# Altium schematic sheet Archimedes_Cevirici_Kati_LM2596.SchDoc
size A4; SheetNumber: 8; SheetTotal: 8
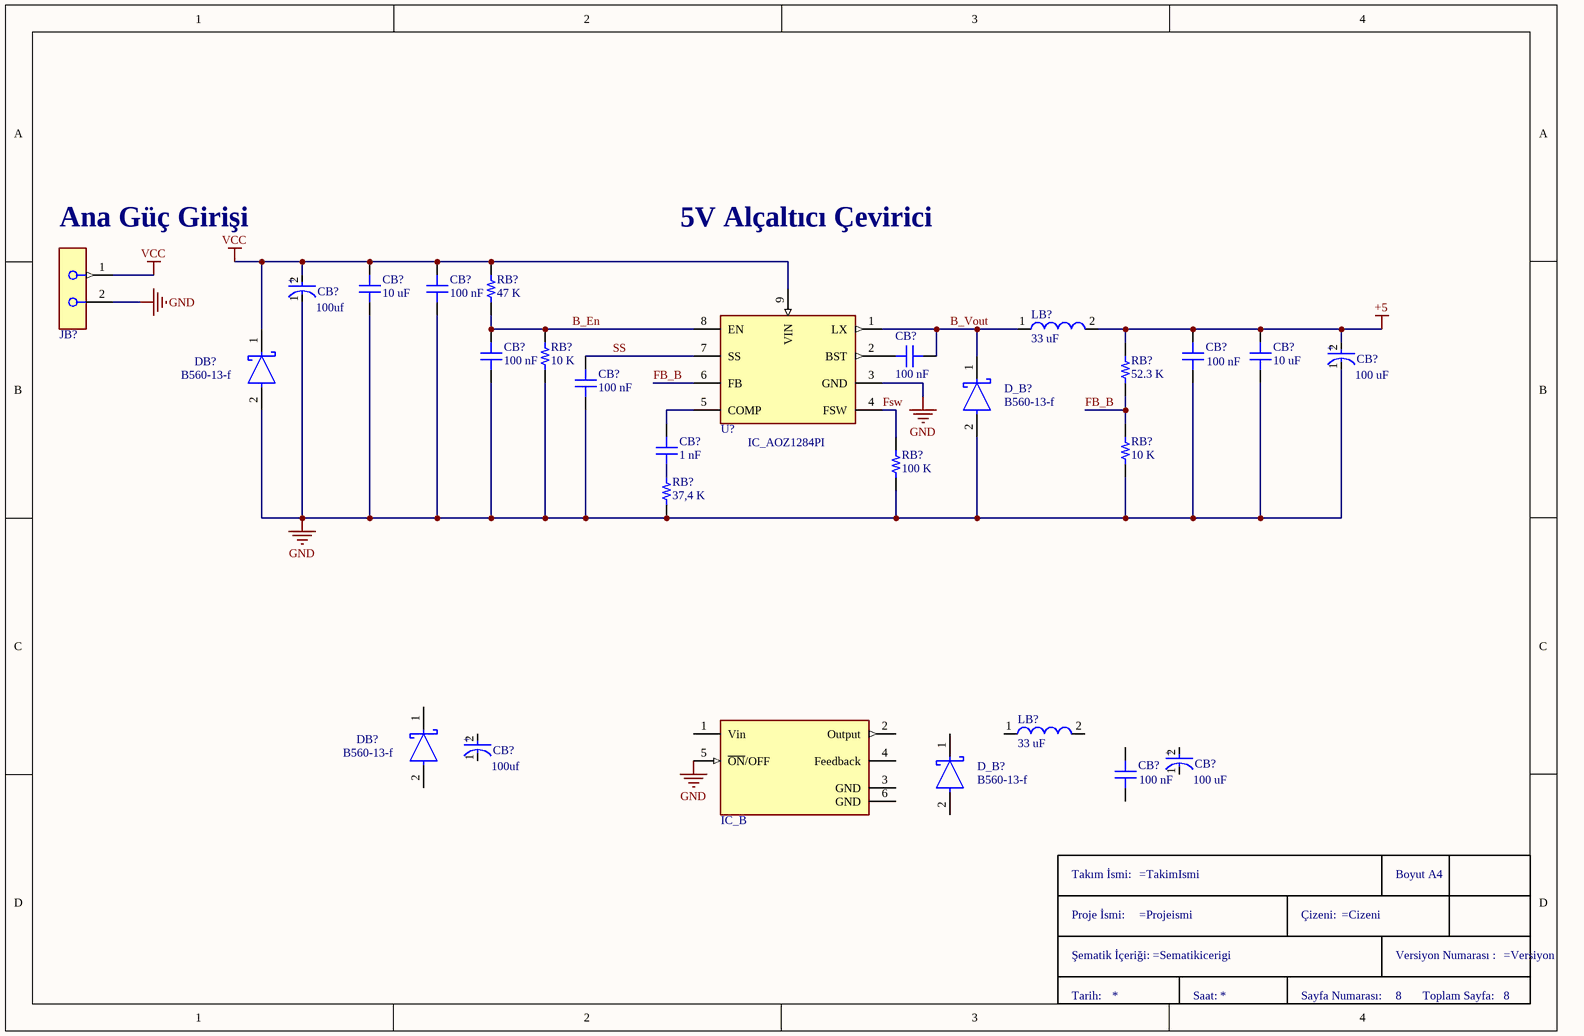
[diagram p0: Archimedes_Cevirici_Kati_LM2596.SchDoc]

## Parts
(Parts that share a designator on the sheet are numbered #1, #2 ... from top to bottom, then left to right.)
CB?#1  100uf  [C_Smd_D6.3_H_7.7_Electrolytic_Cap]
CB?#2  10 uF  [CAP 1206/3216]
CB?#3  100 nF  [CAP 0805/2012]
CB?#4  100 uF  [C_Smd_D6.3_H_7.7_Electrolytic_Cap]
CB?#5  100 nF  [CAP 0805/2012]
CB?#6  100 nF  [CAP 0805/2012]
CB?#7  100 nF  [CAP 0805/2012]
CB?#8  10 uF  [CAP 1206/3216]
CB?#9  100 nF  [CAP 0805/2012]
CB?#10  1 nF  [CAP 0805/2012]
CB?#11  100uf  [C_Smd_D6.3_H_7.7_Electrolytic_Cap]
CB?#12  100 uF  [C_Smd_D6.3_H_7.7_Electrolytic_Cap]
CB?#13  100 nF  [CAP 0805/2012]
D_B?#1  B560-13-f  [D_DO214AB_B560C-13-F]
D_B?#2  B560-13-f  [D_DO214AB_B560C-13-F]
DB?#1  B560-13-f  [D_DO214AB_B560C-13-F]
DB?#2  B560-13-f  [D_DO214AB_B560C-13-F]
IC_B  IC_LM2596DSADJG  [IC_LM2596]  (value not drawn)
JB?  Con_5mm_2 lead  [Con_5mm_2lead]  (value not drawn)
LB?#1  33 uF  [L_12*12_33uh_İnductor]
LB?#2  33 uF  [L_12*12_33uh_İnductor]
RB?#1  47 K  [RES 0805/2012]
RB?#2  10 K  [RES 0805/2012]
RB?#3  52.3 K  [RES 0805/2012]
RB?#4  10 K  [RES 0805/2012]
RB?#5  100 K  [RES 0805/2012]
RB?#6  37,4 K  [RES 0805/2012]
TitleBlock-A4  TitleBlock-A4  (value not drawn)  (graphical)
U?  IC_AOZ1284PI  [IC_AOZ1284_SOP127P]

## Nets
+5: CB?#4.2(A) CB?#7.2 CB?#8.1 LB?#1.2 RB?#3.2
GND: CB?#1.1(C) CB?#2.2 CB?#3.1 CB?#4.1(C) CB?#5.1 CB?#7.1 CB?#8.2 CB?#9.1 D_B?#1.2(A) DB?#1.2(A) IC_B.5(~{ON}/OFF) JB?.2 RB?#2.1 RB?#4.1 RB?#5.1 RB?#6.1 U?.3(GND)
VCC: CB?#1.2(A) CB?#2.1 CB?#3.2 DB?#1.1(C) JB?.1 RB?#1.2 U?.9(VIN)
B_En: CB?#5.2 RB?#1.1 RB?#2.2 U?.8(EN)
B_Vout: CB?#6.1 D_B?#1.1(C) LB?#1.1 U?.1(LX)
FB_B: RB?#3.1 RB?#4.2 U?.6(FB)
Fsw: RB?#5.2 U?.4(FSW)
SS: CB?#9.2 U?.7(SS)
NetCB?#6_2: CB?#6.2 U?.2(BST)
NetCB?#10_1: CB?#10.1 RB?#6.2
NetCB?#10_2: CB?#10.2 U?.5(COMP)

Not connected (* = marked no-connect by the designer): CB?#11 1(C) 2(A); CB?#12 1(C) 2(A); CB?#13 1 2; D_B?#2 1(C) 2(A); DB?#2 1(C) 2(A); IC_B 1(Vin) 2(Output) 3(GND) 4(Feedback) 6(GND); LB?#2 1 2

## Notes on the sheet
- Ana Güç Girişi
- 5V Alçaltıcı Çevirici
- (in symbol C_smd_D6.3_H7.7) +
- (in symbol TitleBlock-A4) Takım İsmi:; Boyut A4; Proje İsmi:; Çizeni:; Şematik İçeriği:; Versiyon Numarası :; Tarih:; Saat:; Sayfa Numarası:; Toplam Sayfa:

## Library data of the parts
CB?#1 CB?#4 CB?#11 CB?#12 = C_smd_D6.3_H7.7: Electrolytic capacitor with 100 uf and 35 volt rating
CB?#2 = Capacitor 1206: 10 uF  and 50 Volt Ceramic Capacitor 1206 pack with X5R rating
CB?#3 CB?#5-CB?#7 CB?#13 = Capacitor 805: 100 nF  and 50 Volt Ceramic Capacitor 805 pack with X7R rating
CB?#8 = Capacitor 1206: 10 uF  and 50 V Ceramic Capacitor 1206 pack with X5R rating
CB?#9 = Capacitor 805: 100 nF and 50 Volt Ceramic Capacitor 805 pack with X7R rating
CB?#10 = Capacitor 805: 1 nF and 50 Volt Ceramic Capacitor 805 pack with X7R rating
D_B?#1 D_B?#2 DB?#1 DB?#2 = D_Do214AB_B560-13-F: Schottky diode with 5A and 60 Volt rating
IC_B = IC_LM2596DSADJG: Generic Buck IC
JB? = Con_5mm_2 lead: TERM BLOCK 2POS SIDE ENTRY 5MM
LB?#1 LB?#2 = L_12_12_33uh_smd_inductor: SMD Flat Wire High Current Inductor WE-HCI, L=33.0 µH; PartNumber: 74435573300; Inductance: 33.0 ÂµH; ComponentLink1Description: Manufacturer Link; ComponentLink2Description: Datasheet; DatasheetVersion: ver 2, Nov-2009; ComponentLink1URL: http://www.we-online.com; PackageVersion: 2009; PackageDescription: Inductor, 2-Leads, Body 18.3 x 18.2 mm; ComponentLink2URL: http://www.we-online.de/katalog/media/pdf/74435573300.pdf; PackageReference: WE-HCI-1890
RB?#1 = Resistor 805: 47 K ohm Resistor  with 805 pack and %1 tolerance rating
RB?#2 RB?#4 = Resistor 805: 10 K ohm Resistor  with 805 pack and %1 tolerance rating
RB?#3 = Resistor 805: 52,3 K ohm Resistor  with 805 pack and %1 tolerance rating
RB?#5 = Resistor 805: 100 K ohm Resistor  with 805 pack and %1 tolerance rating
RB?#6 = Resistor 805: 37,4 K ohm Resistor  with 805 pack and %1 tolerance rating
TitleBlock-A4 = TitleBlock-A4: Title Block for İTU eklemeli imalat takımı
U? = IC_AOZ1284PI: Buck Switching Regulator IC Positive Adjustable 0.8V 1 Output 4A 8-SOIC _0.154, 3.90mm Width_ Exposed Pad; MF: Alpha &; Price: None; Availability: Unavailable; Package: SO-8 Alpha &amp; Omega Semiconductor; SnapEDA_Link: https://www.snapeda.com/parts/AOZ1284PI/Alpha%20%26%20Omega%20Semiconductor%20Inc./view-part/473739/?ref=snap; MP: AOZ1284PI; Value: *